# EAGLE design board (EAGLE 9.6.2)
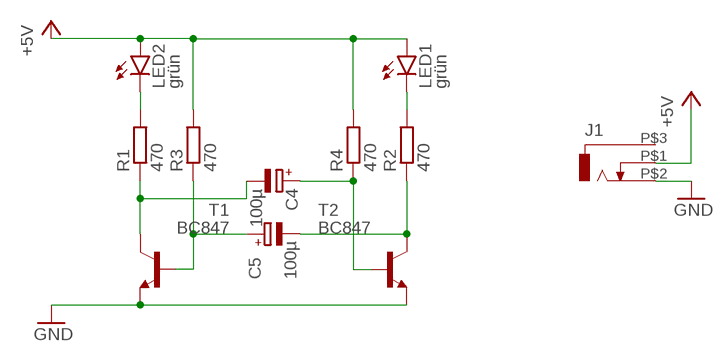
[diagram p0: schematic, sheet 1]

## Parts
C4  100µ  CPOL-EU153CLV-0605  [153CLV-0605]
C5  100µ  CPOL-EU153CLV-0605  [153CLV-0605]
J1  RASM7X2  [RASM7X2]
LED1  grün  LEDCHIPLED_0805  [CHIPLED_0805]
LED2  grün  LEDCHIPLED_0805  [CHIPLED_0805]
R1  470  R-EU_R0805  [R0805]
R2  470  R-EU_R0805  [R0805]
R3  470  R-EU_R0805  [R0805]
R4  470  R-EU_R0805  [R0805]
T1  BC847  [SOT23]
T2  BC847  [SOT23]

## Nets
+5V: J1.P$1 LED1.A LED2.A R3.2 R4.2
GND: J1.P$2 T1.2(E) T2.2(E)
N$3: LED2.C R1.2
N$5: LED1.C R2.2
N$6: C4.- R1.1 T1.3(C)
N$7: C5.- R2.1 T2.3(C)
N$8: C4.+ R4.1 T2.1(B)
N$9: C5.+ R3.1 T1.1(B)
Unconnected: J1.P$3

## Library data of the parts
C4 C5 = resistor:CPOL-EU: POLARIZED CAPACITOR, European symbol
J1 = Hohlstecker-SMD:RASM7X2: DC POWER JACK; OC_FARNELL: unknown; OC_NEWARK: unknown
LED1 LED2 = led:LED: LED OSRAM: - CHIPLED LG R971, LG N971, LY N971, LG Q971, LY Q971, LO R971, LY R971 LH N974, LH R974 LS Q976, LO Q976, LY Q976 LO Q996 - Hyper CHIPLED LW Q18S LB Q993, LB Q99A, LB R99A - SideLED LS A670, LO A670, LY A670, LG A670, LP A670 LB A673, LV A673, LT A673, LW A673 LH A674 LY A675 LS A676, LA A676, LO A676, LY A676, LW A676 LS A679, LY A679, LG A679 - Hyper Micro SIDELED® LS Y876, LA Y876, LO Y876, LY Y876 LT Y87S - SmartLED LW L88C, LW L88S LB L89C, LB L89S, LG L890 LS L89K, LO L89K, LY L89K LS L896, LA L896, LO L896, LY L896 - TOPLED LS T670, LO T670, LY T670, LG T670, LP T670 LSG T670, LSP T670, LSY T670, LOP T670, LYG T670 LG T671, LOG T671, LSG T671 LB T673, LV T673, LT T673, LW T673 LH T674 LS T676, LA T676, LO T676, LY T676, LB T676, LH T676, LSB T676, LW T676 LB T67C, LV T67C, LT T67C, LS T67K, LO T67K, LY T67K, LW E67C LS E67B, LA E67B, LO E67B, LY E67B, LB E67C, LV E67C, LT E67C LW T67C LS T679, LY T679, LG T679 LS T770, LO T770, LY T770, LG T770, LP T770 LB T773, LV T773, LT T773, LW T773 LH T774 LS E675, LA E675, LY E675, LS T675 LS T776, LA T776, LO T776, LY T776, LB T776 LHGB T686 LT T68C, LB T68C - Hyper Mini TOPLED® LB M676 - Mini TOPLED Santana® LG M470 LS M47K, LO M47K, LY M47K Source: http://www.osram.convergy.de LUXEON: - LUMILED® LXK2-PW12-R00, LXK2-PW12-S00, LXK2-PW14-U00, LXK2-PW14-V00 LXK2-PM12-R00, LXK2-PM12-S00, LXK2-PM14-U00 LXK2-PE12-Q00, LXK2-PE12-R00, LXK2-PE12-S00, LXK2-PE14-T00, LXK2-PE14-U00 LXK2-PB12-K00, LXK2-PB12-L00, LXK2-PB12-M00, LXK2-PB14-N00, LXK2-PB14-P00, LXK2-PB14-Q00 LXK2-PR12-L00, LXK2-PR12-M00, LXK2-PR14-Q00, LXK2-PR14-R00 LXK2-PD12-Q00, LXK2-PD12-R00, LXK2-PD12-S00 LXK2-PH12-R00, LXK2-PH12-S00 LXK2-PL12-P00, LXK2-PL12-Q00, LXK2-PL12-R00 Source: www.luxeon.com KINGBRIGHT: KA-3528ASYC Source: www.kingbright.com
R1-R4 = resistor:R-EU_: RESISTOR, European symbol
T1 T2 = transistor:BC847: NPN TRANSISTOR

## Net classes
0 default: clearance 0.205 mm

## Board
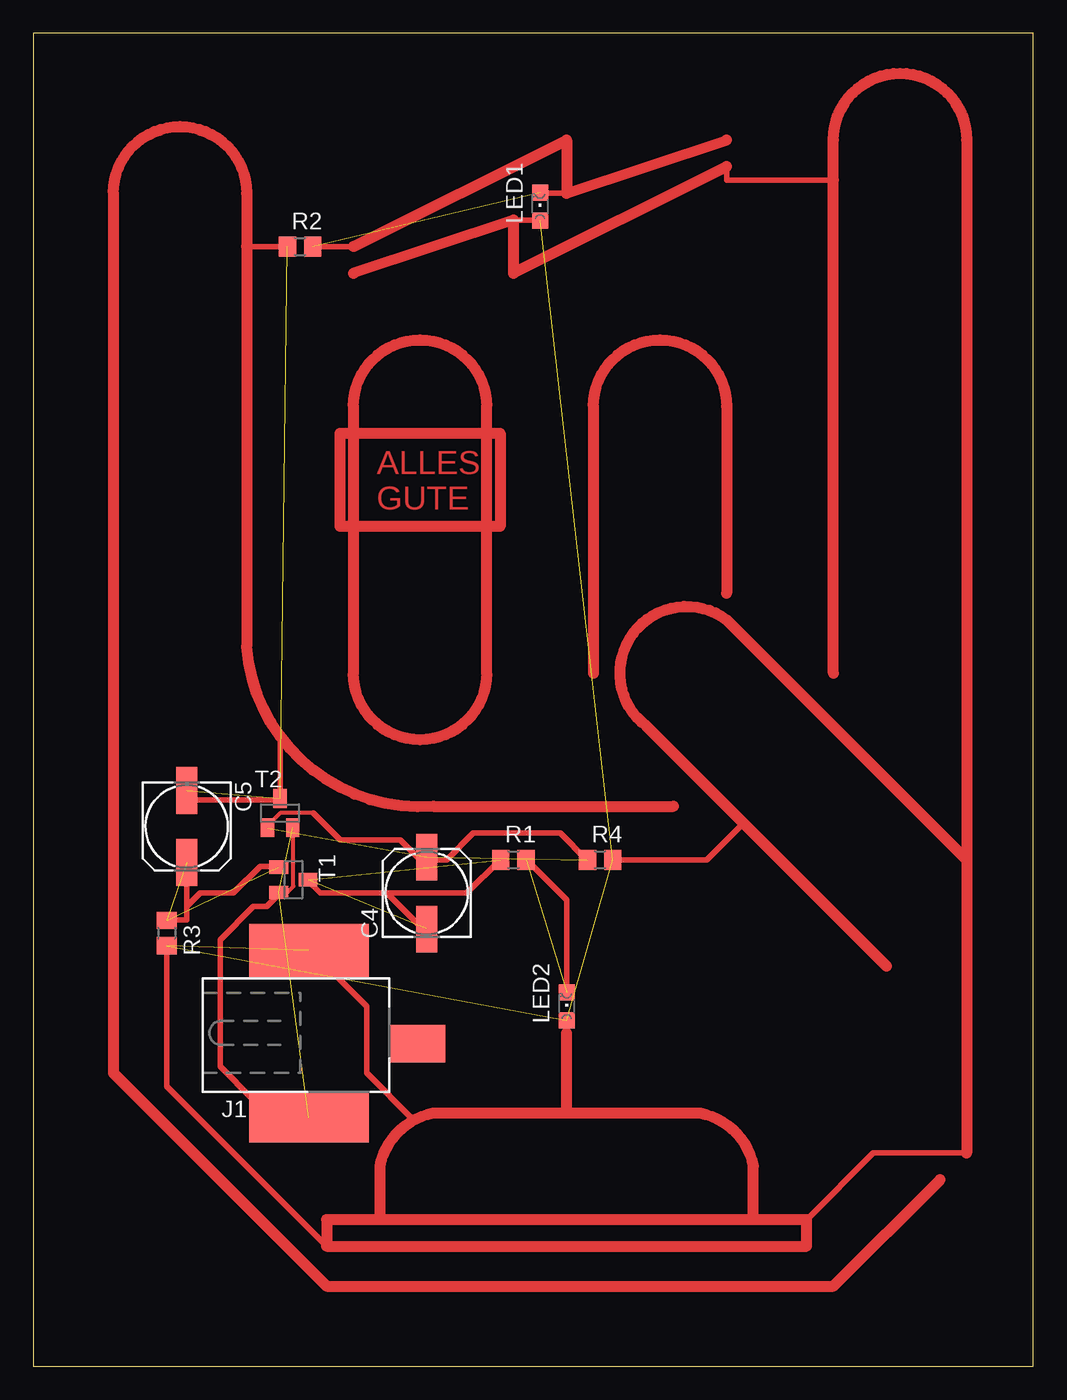
[diagram p1: board, top side]

Size 75 x 100 mm. Coordinates in mm from the lower left corner, seen from the top.
Outline: 75,100 0,100 0,0 75,0 75,100
Copper layers (1*16): Top 0.035mm / dielectric 1.5mm / Bottom 0.035mm
Design rules "default": minimum track width 6mil, minimum drill 0.35mm, track to track 6mil, track to pad 6mil, pad to pad 6mil, via to via 6mil, smd to smd 6mil, copper to edge 40mil, drill to drill 6mil, minimum pad ring 10mil, minimum via ring 8mil, stop-mask expansion 4mil, vias tented up to drill 0mil, thermal gap 10mil

### Footprints (pad centres in the part's own frame; a part is rotated, then mirrored left to right if it is on the bottom)
153CLV-0605 = smd 3.5 x 1.6: + 2.7,0; - -2.7,0
RASM7X2 = smd 3.999 x 8.94: P$1 -6.2,-2.33 | smd 3.7 x 8.94: P$2 6.35,-2.33 | smd 2.8 x 4.06: P$3 0.8,5.85
CHIPLED_0805 = smd 1.2 x 1.2: A 0,-1.05; C 0,1.05
R0805 = smd 1.3 x 1.5: 1 -0.95,0; 2 0.95,0
SOT23 = smd 1 x 1.4: 1 -0.95,-1.1; 2 0.95,-1.1; 3 0,1.1

### Placement (x,y rotation side)
C4  29.5,35.5 90 top
C5  11.5,40.5 270 top
J1  23,25 270 top
LED1  38,87 0 top
LED2  40,27 0 top
R1  36,38 0 top
R2  20,84 0 top
R3  10,32.5 270 top
R4  42.5,38 0 top
T1  19.5,36.5 270 top
T2  18.5,41.5 0 top

### Tracks (layer width: path | path; a pad name or v marks a point on that pad's centre or on a via)
+5V  (4 unrouted)
GND  (2 unrouted)
N$1
  Top 0.406: 10,33.5 11.5,33.5 11.5,34.5 | 11.5,34.5 11.5,36.5 | 11.5,34.5 12.5,35.5 15,35.5 17,37.5 18.5,37.5
N$2
  Top 0.813: 52,58 52,72 arc180 42,72 42,52
N$3  (1 unrouted)
N$4
  Top 0.406: 19,84 16,84
  Top 0.813: 48,42 30,42 arc-90 16,54 16,84 16,88 arc180 6,88 6,22 22,6 60,6 68,14
N$5  (1 unrouted)
N$6  (2 unrouted)
N$7  (2 unrouted)
N$8  (2 unrouted)
N$9  (2 unrouted)
N$10
  Top 0.305: 11.5,43 12,42.5
  Top 0.406: 12,42.5 18.5,42.5 18.5,47.5
N$11
  Top 0.305: 19,35.5 19.5,36 19.5,40
N$12
  Top 0.813: 24,70 24,72 arc-180 34,72 34,52 arc-180 24,52 24,70 | 24,70 23,70 23,63 35,63 35,70 26,70 25.5,70 24,70
N$13
  Top 0.406: 20.5,36.5 21.5,35.5 26.5,35.5 | 26.5,35.5 29.5,32.5 | 26.5,35.5 32.5,35.5 35,38
N$14
  Top 0.406: 37,38 40,35 40,28
N$15
  Top 0.305: 21,41.5 18.5,41.5 17.5,40.5
  Top 0.406: 41.5,38 39.5,40 33,40 31,38 29,38 27.5,39.5 23,39.5 21,41.5
N$16
  Top 0.406: 43.5,38 50.5,38 53,40.5
N$17
  Top 0.406: 18.5,35.5 17.5,34.5 16.5,34.5 14,32 14,22.5 16.5,20
N$18
  Top 0.406: 21.5,30.5 25,27 25,22 28.5,18.5
N$20
  Top 0.406: 38,86 36,86 | 52,90 52,89 60,89 | 58,11 63,16 70,16 | 10,31 10,21 22,9
  Top 0.813: 54,11 58,11 58,9 22,9 22,11 26,11 | 54,11 26,11 | 54,11 54,15 arc67 50,19 40,19 | 26,11 26,15 arc-67 30,19 40,19 | 40,19 40,25 | 24,82 36,86 36,82 52,90 | 60,52 60,89 60,92 arc-180 70,92 70,38 | 70,38 52,56 arc180 46,48 64,30 | 70,38 70,16
N$22
  Top 0.406: 38,88 40,88 | 21,84 24,84
  Top 0.813: 24,84 40,92 40,88 52,92

### Text on the board
Top: ALLES / GUTE